# EAGLE design relais platine simplified (EAGLE 6.1)
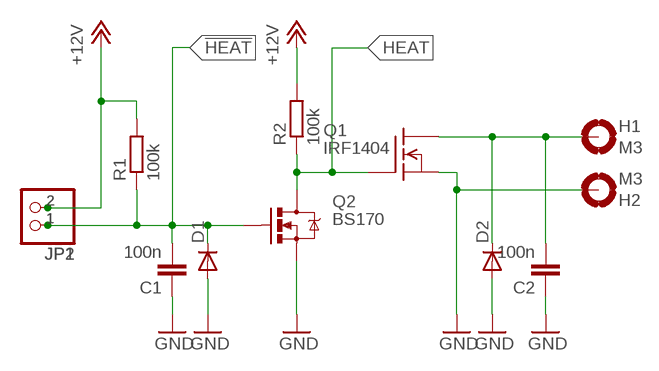
[diagram p0: schematic, sheet 1]

## Parts
C1  100n  C-EUC0805K  [C0805K]
C2  100n  C-EUC0805K  [C0805K]
D1  DIODE-MINIMELF  [MINIMELF]
D2  DIODE-MINIMELF  [MINIMELF]
H1  M3  MOUNT-PAD-ROUND3.0  [3,0-PAD]
H2  M3  MOUNT-PAD-ROUND3.0  [3,0-PAD]
JP1  PINHD-1X2  [1X02]
JP2  PINHD-1X2/90  [1X02/90]
Q1  IRF1404  IRF540  [TO220]
Q2  BS170  MOSFET-NCHANNELBSS123LT1G  [SOT23-3]
R1  100k  R-EU_M0805  [M0805]
R2  100k  R-EU_M0805  [M0805]

## Nets
!HEAT: C1.2 D1.C JP1.1 JP2.1 Q2.1(G) R1.1
+12V: JP1.2 JP2.2 R1.2 R2.2
GND: C1.1 C2.1 D1.A D2.A H2.B3,0(MOUNT) Q1.3(S) Q2.2(S)
HEAT: Q1.1(G) Q2.3(D) R2.1
HIGH: C2.2 D2.C H1.B3,0(MOUNT) Q1.2(D)

## Library data of the parts
C1 C2 = rcl:C-EU: CAPACITOR, European symbol
D1 D2 = diode:DIODE-: DIODE
H1 H2 = holes:MOUNT-PAD-ROUND: MOUNTING PAD, round
JP1 JP2 = pinhead:PINHD-1X2: PIN HEADER
Q1 = transistor-fet:IRF540: N-Channel Enhancement MOSFET (HEXFET); 100V; 28A; 0,077Ohm
Q2 = SparkFun-DiscreteSemi:MOSFET-NCHANNEL: Common NMOSFET Parts MFG P/N Store ID Prod ID FDD8780 TRANS-09984 SI7820DN TRANS-11055 FDS6630A IC-08089 2N7002PW TRANS-11151 FQP30N06L COM-10213 TRANS-10060 BSS123LT1G TRANS-08345 BSS138 TRANS-00830 BS170 2N7000; PROD_ID: TRANS-08345
R1 R2 = rcl:R-EU_: RESISTOR, European symbol

## Board
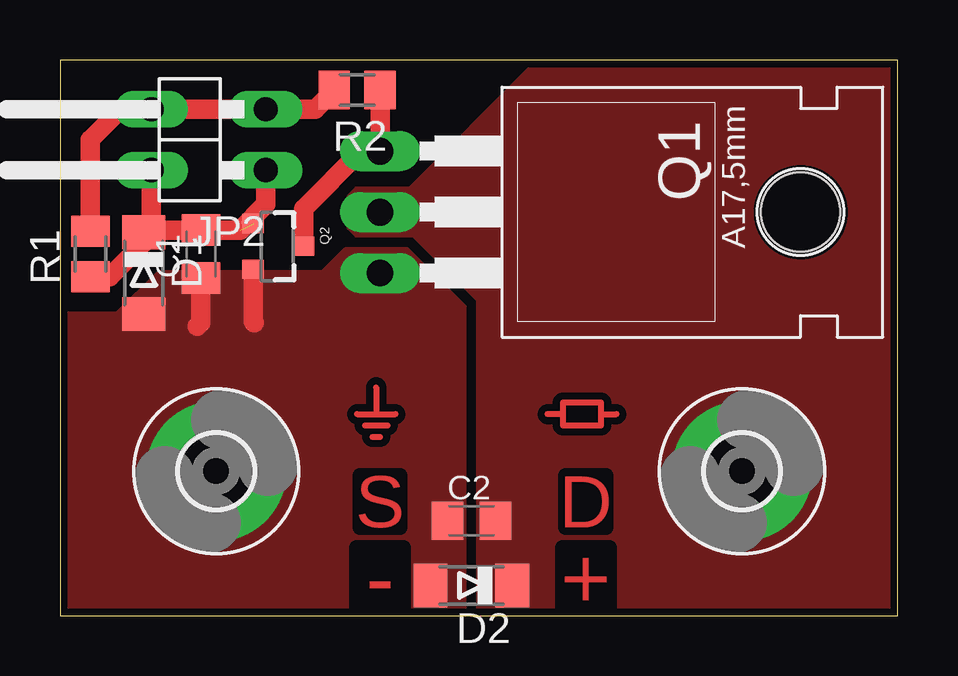
[diagram p1: board, top side]
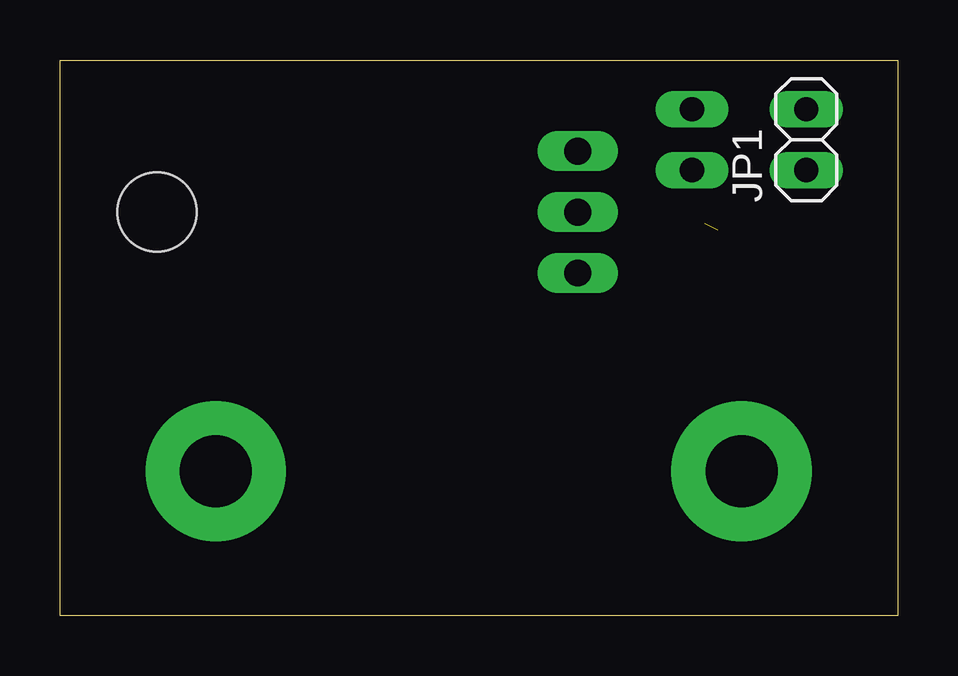
[diagram p2: board, bottom side, seen from below]

Size 34.91 x 23.16 mm. Coordinates in mm from the lower left corner, seen from the top.
Outline: 0,0 34.91,0 34.91,23.16 0,23.16 0,0
Copper layers (1*16): Top 0.035mm / dielectric 1.5mm / Bottom 0.035mm
Design rules: minimum track width 10mil, minimum drill 24mil, track to track 12mil, track to pad 12mil, pad to pad 12mil, via to via 12mil, smd to smd 10mil, copper to edge 12mil, drill to drill 12mil, minimum pad ring 10mil, minimum via ring 10mil, stop-mask expansion 4mil, vias tented up to drill 0mil, thermal gap 12mil

### Footprints (pad centres in the part's own frame; a part is rotated, then mirrored left to right if it is on the bottom)
C0805K = smd 1.3 x 1.6: 1 -1,0; 2 1,0
MINIMELF = smd 1.4 x 1.8: A 1.7,0; C -1.7,0
3,0-PAD = drill 3 pad 5.842: B3,0 0,0
1X02 = drill 1.016 long: 1 -1.27,0; 2 1.27,0
1X02/90 = drill 1.016 long: 1 -1.27,-3.81; 2 1.27,-3.81
TO220 = drill 1.118 long: 1 -2.54,-6.35; 2 0,-6.35; 3 2.54,-6.35 | hole 3.302: 0,11.176
SOT23-3 = smd 0.8 x 0.9: 1 -0.95,-1; 2 0.95,-1; 3 0,1.1
M0805 = smd 1.3 x 1.6: 1 -0.95,0; 2 0.95,0

### Placement (x,y rotation side)
C1  5.87,15.08 90 top
C2  17.14,3.97 0 top
D1  3.49,14.29 270 top
D2  17.14,1.27 180 top
H1  28.42,6.03 0 top
H2  6.51,6.03 0 top
JP1  3.81,19.84 90 bottom
JP2  4.76,19.84 90 top
Q1  19.68,16.83 270 top
Q2  9.05,15.4 270 top
R1  1.27,15.08 90 top
R2  12.38,21.91 180 top

### Tracks (layer width: path | path; a pad name or v marks a point on that pad's centre or on a via)
!HEAT  (1 unrouted)
  Top 0.813: R1.1 2.07,14.13 3.49,15.56 D1.C | D1.C 3.49,16.03 | D1.C 3.59,16.08 C1.2 7.51,16.08 8.57,17.14 JP2.1 | JP1.1 3.81,16.3 D1.C
+12V
  Top 0.813: R1.2 1.27,19.84 2.54,21.11 JP1.2 JP2.2 10.64,21.11 R2.2
GND
  Top 0.813: C1.1 5.87,12.22 5.71,12.06 | Q2.2 8.05,12.27 8.1,12.22
  pour Top (no thermals): 14.45,15.24 11.91,15.24 10.95,14.29 4.13,14.29 2.38,12.54 0,12.54 0,0 16.83,0 16.83,12.86
HEAT
  Top 0.813: Q2.3 10.15,16.98 12.54,19.37 Q1.1 R2.1
HIGH
  pour Top (no thermals): 17.46,0 17.46,13.18 14.76,15.88 12.38,15.88 12.06,16.19 12.06,17.46 12.38,17.78 14.61,17.78 19.68,22.86 34.92,22.86 34.92,0
N$3
  Top 0.254: 13.18,9.53 13.18,8.41
N$4
  Top 0.254: 12.38,8.41 13.97,8.41
N$5
  Top 0.254: 12.7,7.94 13.65,7.94
N$6
  Top 0.254: 13.02,7.46 13.34,7.46
N$7
  Top 0.254: 22.54,8.41 22.54,7.94 20.95,7.94 20.95,8.41 | 22.54,8.41 22.54,8.89 20.95,8.89 20.95,8.41 | 20.95,8.41 20.32,8.41 | 22.54,8.41 23.18,8.41

### Text on the board
Top: S | D | - | +